# EAGLE design 4enc (EAGLE 6.4)
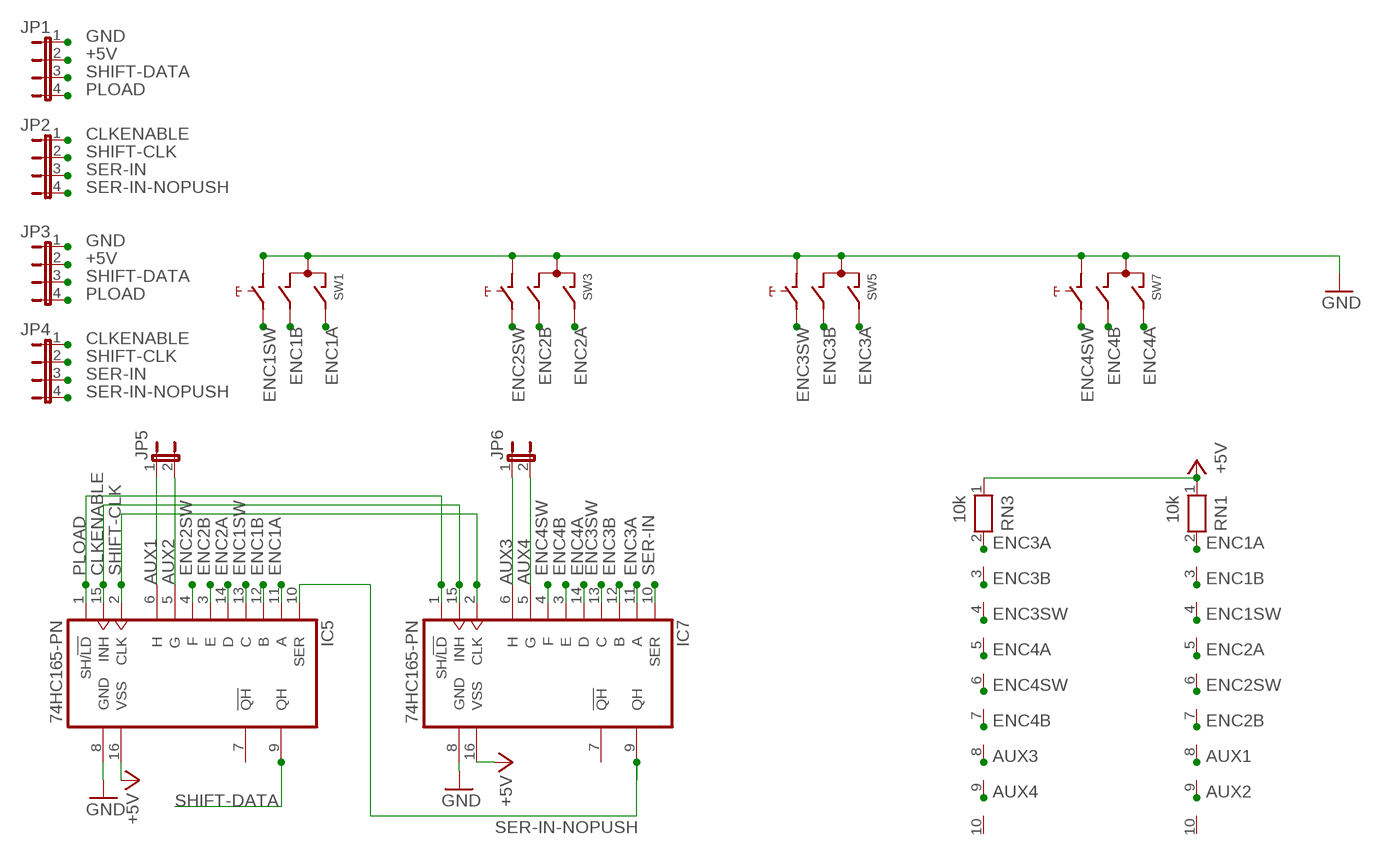
[diagram p0: schematic, sheet 1]

## Parts
IC5  74HC165-PN  [DIL16]
IC7  74HC165-PN  [DIL16]
JP1  JP4E  [JP4]
JP2  JP4E  [JP4]
JP3  JP4E  [JP4]
JP4  JP4E  [JP4]
JP5  JP1E  [JP1]
JP6  JP1E  [JP1]
RN1  10k  RN09  [RN-10]
RN3  10k  RN09  [RN-10]
SW1  EC12E_SW  [ALPS_EC12E_SW]
SW3  EC12E_SW  [ALPS_EC12E_SW]
SW5  EC12E_SW  [ALPS_EC12E_SW]
SW7  EC12E_SW  [ALPS_EC12E_SW]

## Nets
+5V: IC5.16(VSS) IC7.16(VSS) JP1.2 JP3.2 RN1.1 RN3.1
AUX1: IC5.6(H) JP5.1 RN1.8
AUX2: IC5.5(G) JP5.2 RN1.9
AUX3: IC7.6(H) JP6.1 RN3.8
AUX4: IC7.5(G) JP6.2 RN3.9
CLKENABLE: IC5.15(INH) IC7.15(INH) JP2.1 JP4.1
ENC1A: IC5.11(A) RN1.2 SW1.A
ENC1B: IC5.12(B) RN1.3 SW1.B
ENC1SW: IC5.13(C) RN1.4 SW1.E
ENC2A: IC5.14(D) RN1.5 SW3.A
ENC2B: IC5.3(E) RN1.7 SW3.B
ENC2SW: IC5.4(F) RN1.6 SW3.E
ENC3A: IC7.11(A) RN3.2 SW5.A
ENC3B: IC7.12(B) RN3.3 SW5.B
ENC3SW: IC7.13(C) RN3.4 SW5.E
ENC4A: IC7.14(D) RN3.5 SW7.A
ENC4B: IC7.3(E) RN3.7 SW7.B
ENC4SW: IC7.4(F) RN3.6 SW7.E
GND: IC5.8(GND) IC7.8(GND) JP1.1 JP3.1 SW1.C SW1.D SW3.C SW3.D SW5.C SW5.D SW7.C SW7.D
PLOAD: IC5.1(SH/!LD) IC7.1(SH/!LD) JP1.4 JP3.4
SER-IN: IC7.10(SER) JP2.3 JP4.3
SER-IN-NOPUSH: IC5.10(SER) IC7.9(QH) JP2.4 JP4.4
SHIFT-CLK: IC5.2(CLK) IC7.2(CLK) JP2.2 JP4.2
SHIFT-DATA: IC5.9(QH) JP1.3 JP3.3
Unconnected: IC5.7(!QH) IC7.7(!QH) RN1.10 RN3.10 SW1.GND1(G) SW1.GND2(G) SW3.GND1(G) SW3.GND2(G) SW5.GND1(G) SW5.GND2(G) SW7.GND1(G) SW7.GND2(G)

## Library data of the parts
IC5 IC7 = 74xx-us:74*165-P: 8-bit parallel load SHIFT REGISTER; PWR: 1
JP1-JP4 = jumper:JP4E: JUMPER
JP5 JP6 = jumper:JP1E: JUMPER
RN1 RN3 = resistor-net:RN09: RESISTOR NETWORK; OC_FARNELL: unknown; OC_NEWARK: unknown
SW1 SW3 SW5 SW7 = switch-alps:EC12E_SW: ALPS rotary Encoder EC12E series with switch; MPN: EC12E2424407; OC_FARNELL: 1520813; OC_NEWARK: 74M1068

## Board
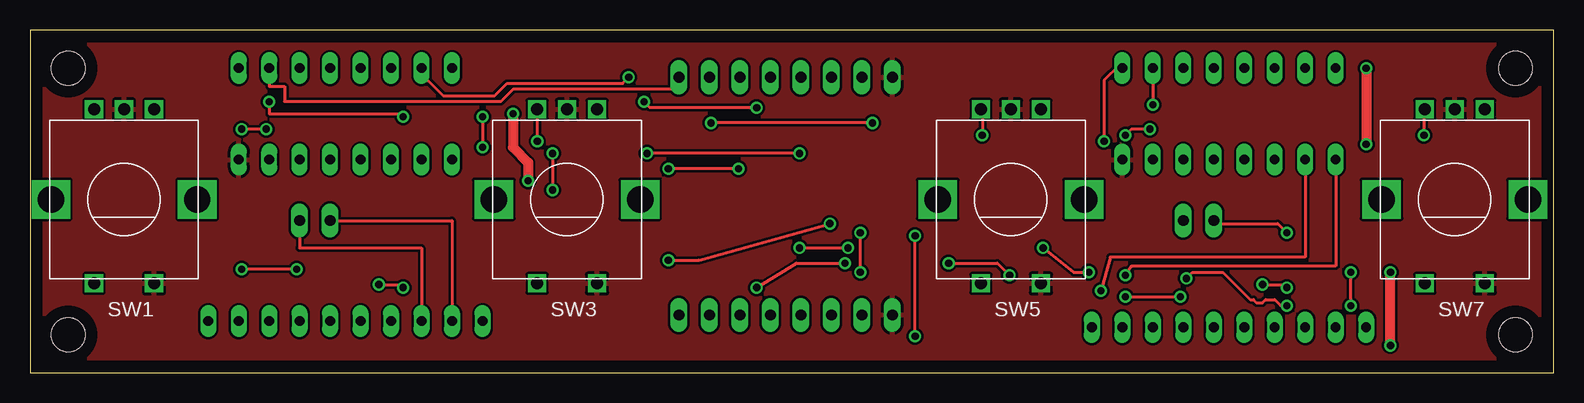
[diagram p1: board, top side]
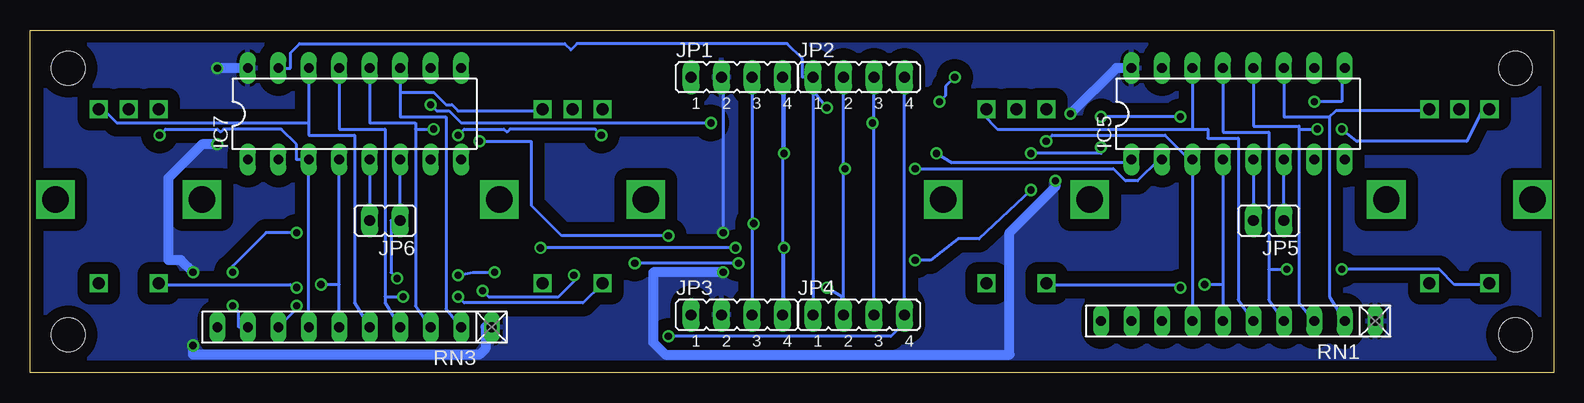
[diagram p2: board, bottom side, seen from below]

Size 127 x 28.57 mm. Coordinates in mm from the lower left corner, seen from the top.
Outline: 0,0 127,0 127,28.57 0,28.57 0,0
Copper layers (1*16): Top 0.035mm / dielectric 1.5mm / Bottom 0.035mm
Design rules "default": minimum track width 10mil, minimum drill 24mil, track to track 8mil, track to pad 8mil, pad to pad 8mil, via to via 8mil, smd to smd 8mil, copper to edge 40mil, drill to drill 8mil, minimum pad ring 10mil, minimum via ring 8mil, stop-mask expansion 4mil, vias tented up to drill 0mil, thermal gap 10mil
Holes 2.8 mm at 3.17,25.4 3.17,3.17 123.83,3.17 123.83,25.4

### Footprints (pad centres in the part's own frame; a part is rotated, then mirrored left to right if it is on the bottom)
DIL16 = drill 0.813 long: 1 -8.89,-3.81; 2 -6.35,-3.81; 3 -3.81,-3.81; 4 -1.27,-3.81; 5 1.27,-3.81; 6 3.81,-3.81; 7 6.35,-3.81; 8 8.89,-3.81; 9 8.89,3.81; 10 6.35,3.81; 11 3.81,3.81; 12 1.27,3.81; 13 -1.27,3.81; 14 -3.81,3.81; 15 -6.35,3.81; 16 -8.89,3.81
JP4 = drill 0.914 long: 1 -3.81,0; 2 -1.27,0; 3 1.27,0; 4 3.81,0
JP1 = drill 0.914 long: 1 0,-1.27; 2 0,1.27
RN-10 = drill 0.813 long: 1 -11.43,0; 2 -8.89,0; 3 -6.35,0; 4 -3.81,0; 5 -1.27,0; 6 1.27,0; 7 3.81,0; 8 6.35,0; 9 8.89,0; 10 11.43,0
ALPS_EC12E_SW = drill 1 square: A -2.5,-7.5; B 2.5,-7.5; C 0,-7.5; D -2.5,7; E 2.5,7 | drill 2.2 square: GND1 -6.1,0; GND2 6.1,0

### Placement (x,y rotation side)
IC5  26.29,21.59 0 bottom
IC7  99.95,21.59 0 bottom
JP1  68.07,24.64 0 bottom
JP2  57.91,24.64 0 bottom
JP3  68.07,4.83 0 bottom
JP4  57.91,4.83 0 bottom
JP5  23.75,12.7 90 bottom
JP6  97.41,12.7 90 bottom
RN1  26.29,4.32 180 bottom
RN3  99.95,3.81 180 bottom
SW1  7.84,14.46 180 top
SW3  44.77,14.46 180 top
SW5  81.77,14.46 180 top
SW7  118.77,14.46 180 top

### Tracks (layer width: path | path; a pad name or v marks a point on that pad's centre or on a via)
+5V  (via drill 0.6)
  Top 0.254: v69.22,8.38 v69.22,11.68
  Top 0.813: v111.38,25.4 v111.38,19.05 | v113.41,2.29 v113.41,8.38 | v41.53,16 41.53,17.53 40.26,18.8 v40.26,21.59
  Bottom 0.254: v69.22,11.68 69.22,24.64 JP1.2 | v69.22,8.38 69.31,8.31
  Bottom 0.813: v111.38,19.05 112.65,19.05 115.44,16.26 115.44,9.4 114.43,9.4 v113.41,8.38 | IC7.16 v111.38,25.4 | v113.41,2.29 113.41,1.52 89.53,1.52 89.03,2.03 89.03,3.81 RN3.1 | v41.53,16 41.53,15.49 45.34,11.68 45.34,1.52 74.04,1.52 75.06,2.54 75.06,8.38 v69.22,8.38 | v40.26,21.59 36.45,25.4 IC5.16
  pour Bottom (isolate 1.016): 1,27.38 125.7,27.38 125.7,1 1,1
AUX1
  Top 0.254: JP5.1 22.48,10.41 32.64,10.41 RN1.8
  Bottom 0.254: JP5.1 IC5.6
AUX2
  Top 0.254: JP5.2 35.18,12.7 RN1.9
  Bottom 0.254: IC5.5 JP5.2
AUX3  (via drill 0.6)
  Top 0.254: v104.78,5.59 104.52,5.33 103.76,6.1 103,6.1 102.74,5.84 102.23,5.84 101.98,6.1 101.73,6.1 99.44,8.38 96.9,8.38 v96.39,7.87
  Bottom 0.254: IC7.6 JP6.1 96.9,12.7 96.9,8.38 v96.39,7.87 | RN3.8 104.78,5.33 v104.78,5.59
AUX4  (via drill 0.6)
  Top 0.254: v104.78,11.68 104.01,12.45 98.68,12.45 JP6.2 | v110.11,5.59 v110.11,8.38
  Bottom 0.254: IC7.5 JP6.2 | v104.78,11.68 107.31,11.68 110.11,8.89 v110.11,8.38 | v110.11,5.59 109.6,5.08 109.6,3.81 RN3.9
CLKENABLE  (via drill 0.6)
  Top 0.254: v51.18,22.61 51.69,22.1 v60.58,22.1 | v49.91,24.64 49.4,24.13 39.75,24.13 38.73,23.11 34.42,23.11 32.64,24.89 IC5.15
  Bottom 0.254: JP2.1 JP4.1 | v51.18,22.61 50.67,23.11 50.67,23.88 v49.91,24.64 | v60.58,22.1 61.59,23.37 JP2.1 | IC7.15 105.28,25.4 105.28,26.67 104.52,27.43 82.42,27.43 81.92,26.92 81.41,27.43 63.88,27.43 62.61,26.16 62.61,24.64 JP2.1
ENC1A
  Bottom 0.254: IC5.11 22.48,21.34 18.67,21.34 | 18.67,21.34 18.67,6.35 RN1.2 | 18.67,21.34 18.16,21.84 10.54,21.84 SW1.A
ENC1B  (via drill 0.6)
  Top 0.254: v19.68,20.32 v17.65,20.32
  Bottom 0.254: IC5.12 25.02,20.57 21.21,20.57 21.21,20.32 | 21.21,20.32 21.21,5.84 RN1.3 | 21.21,20.32 v19.68,20.32 | v17.65,20.32 16.38,19.3 7.24,19.3 5.97,21.84 5.46,21.84 SW1.B
ENC1SW  (via drill 0.6)
  Top 0.254: v22.22,8.64 v17.65,8.64
  Bottom 0.254: IC5.13 27.56,20.07 23.75,20.07 23.75,8.64 | 23.75,8.64 23.75,6.1 RN1.4 | SW1.E 5.46,7.37 8.25,7.37 9.52,8.64 v17.65,8.64 17.91,8.64 | 23.75,8.64 v22.22,8.64
ENC2A
  Bottom 0.254: IC5.14 30.1,20.32 | 30.1,20.32 28.83,20.32 28.83,19.56 26.29,19.56 26.29,6.1 RN1.5 | 30.1,20.32 46.36,20.32 47.62,21.59 47.62,21.84 47.37,21.84 SW3.A
ENC2B  (via drill 0.6)
  Top 0.254: v42.29,19.3 42.29,21.84 SW3.B
  Bottom 0.254: RN1.7 IC5.3 30.35,17.78 32.39,19.81 41.78,19.81 v42.29,19.3
ENC2SW  (via drill 0.6)
  Top 0.254: v31.11,7.11 30.86,7.37 v29.08,7.37
  Bottom 0.254: IC5.4 27.56,7.37 | 27.56,7.37 RN1.6 | SW3.E 42.04,7.37 31.11,7.37 30.86,7.11 v31.11,7.11 | 27.56,7.37 v29.08,7.37
ENC3A
  Bottom 0.254: IC7.11 96.14,23.37 | 96.14,23.37 96.14,21.34 92.33,21.34 92.33,5.33 RN3.2 | 96.14,23.37 93.34,23.37 92.33,22.35 91.82,22.35 91.31,21.84 84.45,21.84 SW5.A
ENC3B  (via drill 0.6)
  Top 0.254: v91.31,19.81 91.82,20.32 v93.34,20.32 | v79.38,19.81 79.38,21.84 SW5.B
  Bottom 0.254: IC7.12 98.68,20.83 94.87,20.83 94.87,20.32 | 94.87,20.32 94.87,5.59 RN3.3 | v91.31,19.81 90.81,20.32 87.5,20.32 87.25,20.07 87,20.32 79.88,20.32 v79.38,19.81 | 94.87,20.32 v93.34,20.32
ENC3SW  (via drill 0.6)
  Top 0.254: v91.31,6.35 v95.89,6.35
  Bottom 0.254: IC7.13 101.22,20.32 97.41,20.32 97.41,6.35 | 97.41,6.35 97.41,5.84 RN3.4 | v91.31,6.35 90.81,5.84 80.9,5.84 79.38,7.37 SW5.E | 97.41,6.35 v95.89,6.35
ENC4A
  Bottom 0.254: IC7.14 103.76,20.83 | 103.76,20.83 103.76,19.81 99.95,19.81 99.95,5.84 RN3.5 | 103.76,20.83 119.76,20.83 120.78,21.84 121.03,21.84 SW7.A
ENC4B  (via drill 0.6)
  Top 0.254: v116.2,19.81 116.2,21.84 SW7.B
  Bottom 0.254: RN3.7 IC7.3 104.78,17.78 104.78,19.05 106.05,20.32 110.87,20.32 111.12,20.07 111.38,20.32 115.7,20.32 v116.2,19.81
ENC4SW  (via drill 0.6)
  Top 0.254: v104.78,7.11 104.52,7.37 v102.74,7.37
  Bottom 0.254: RN3.6 101.22,7.37 | 101.22,7.37 IC7.4 | SW7.E 116.2,7.37 105.28,7.37 104.78,6.86 v104.78,7.11 | 101.22,7.37 v102.74,7.37
GND
  pour Top: 0,28.38 126.7,28.38 126.7,1 0,1
PLOAD  (via drill 0.6)
  Top 0.254: v64.14,18.29 v51.44,18.29 | v88.27,8.38 87,8.38 v84.45,10.41 | v64.14,10.41 v68.2,10.41 | v91.31,8.13 91.82,8.89 108.84,8.89 IC7.1
  Bottom 0.254: v51.44,18.29 50.17,17.53 35.43,17.53 IC5.1 | v64.14,18.29 64.14,24.64 JP1.4 JP3.4 64.14,4.83 v64.14,10.41 | v68.2,10.41 v84.45,10.41 | v88.27,8.38 90.04,8.38 v91.31,8.13
SER-IN  (via drill 0.6)
  Top 0.254: IC7.10 v93.6,22.35 | v70.23,20.83 v56.77,20.83
  Bottom 0.254: JP4.3 56.64,20.83 | 56.64,20.83 JP2.3 | v70.23,20.83 91.06,20.83 92.08,21.84 93.09,21.84 v93.6,22.35 | v56.77,20.83 56.64,20.83
SER-IN-NOPUSH  (via drill 0.6)
  Top 0.254: JP2.4 53.98,23.88 53.98,23.62 40.26,23.62 39.24,22.61 21.21,22.61 21.21,23.88 19.94,23.88 IC5.10 | v89.53,19.3 89.53,24.38 90.81,25.65 91.06,25.65 IC7.9 | v73.79,3.05 v73.79,11.43
  Bottom 0.254: JP2.4 JP4.4 53.72,4.83 53.72,4.57 55.25,3.05 v73.79,3.05 | v89.53,19.3 85.22,19.3 85.22,13.97 82.68,11.43 v73.79,11.43
SHIFT-CLK  (via drill 0.6)
  Top 0.254: v59.05,17.02 v53.21,17.02 | v81.66,8.13 81.41,8.13 81.41,8.38 80.64,9.14 v76.58,9.14 | v67.95,9.14 63.88,9.14 v60.58,7.11 | v89.28,6.86 90.04,9.65 106.3,9.65 IC7.2
  Bottom 0.254: 59.18,17.02 JP4.2 59.31,4.83 59.31,6.35 v60.58,7.11 | 59.18,17.02 JP2.2 | IC5.2 32.89,17.78 34.67,16 35.69,16 36.7,17.02 v53.21,17.02 | v67.95,9.14 v76.58,9.14 | v81.66,8.13 81.66,7.62 82.93,6.35 88.77,6.35 v89.28,6.86 | v59.05,17.02 59.18,17.02
SHIFT-DATA  (via drill 0.6)
  Top 0.254: v19.94,22.61 19.94,21.59 31.11,21.59 v31.11,21.34 | v37.72,21.34 v37.72,18.8 | v43.56,18.29 v43.56,15.24 | v66.67,12.45 55.75,9.4 v53.21,9.4
  Bottom 0.254: JP1.3 66.8,12.45 | 66.8,12.45 JP3.3 | v19.94,22.61 17.65,22.61 17.65,25.4 IC5.9 | v31.11,21.34 v37.72,21.34 | v43.56,15.24 47.88,11.18 49.66,11.18 51.94,9.4 v53.21,9.4 | v43.56,18.29 37.72,18.29 v37.72,18.8 | v66.67,12.45 66.8,12.45